# Altium schematic sheet ELC102 - ScoreBoard - TopLevel.SchDoc
size C; PageSetup: Record=PageOptions|CenterHorizontal=True|CenterVertical=True|PrintScale=0.33|XCorrection=1.00|YCorrection=1.00|PrintKind=0|BorderSize=5000000|LeftOffset=0|BottomOffset=0|Orientation=2|PaperLength=1000|PaperWidth=1000|Scale=100|PaperSource=15|PrintQuality=1200|MediaType=1|DitherType=10|PaperKind=11x17|PrintScaleMode=1
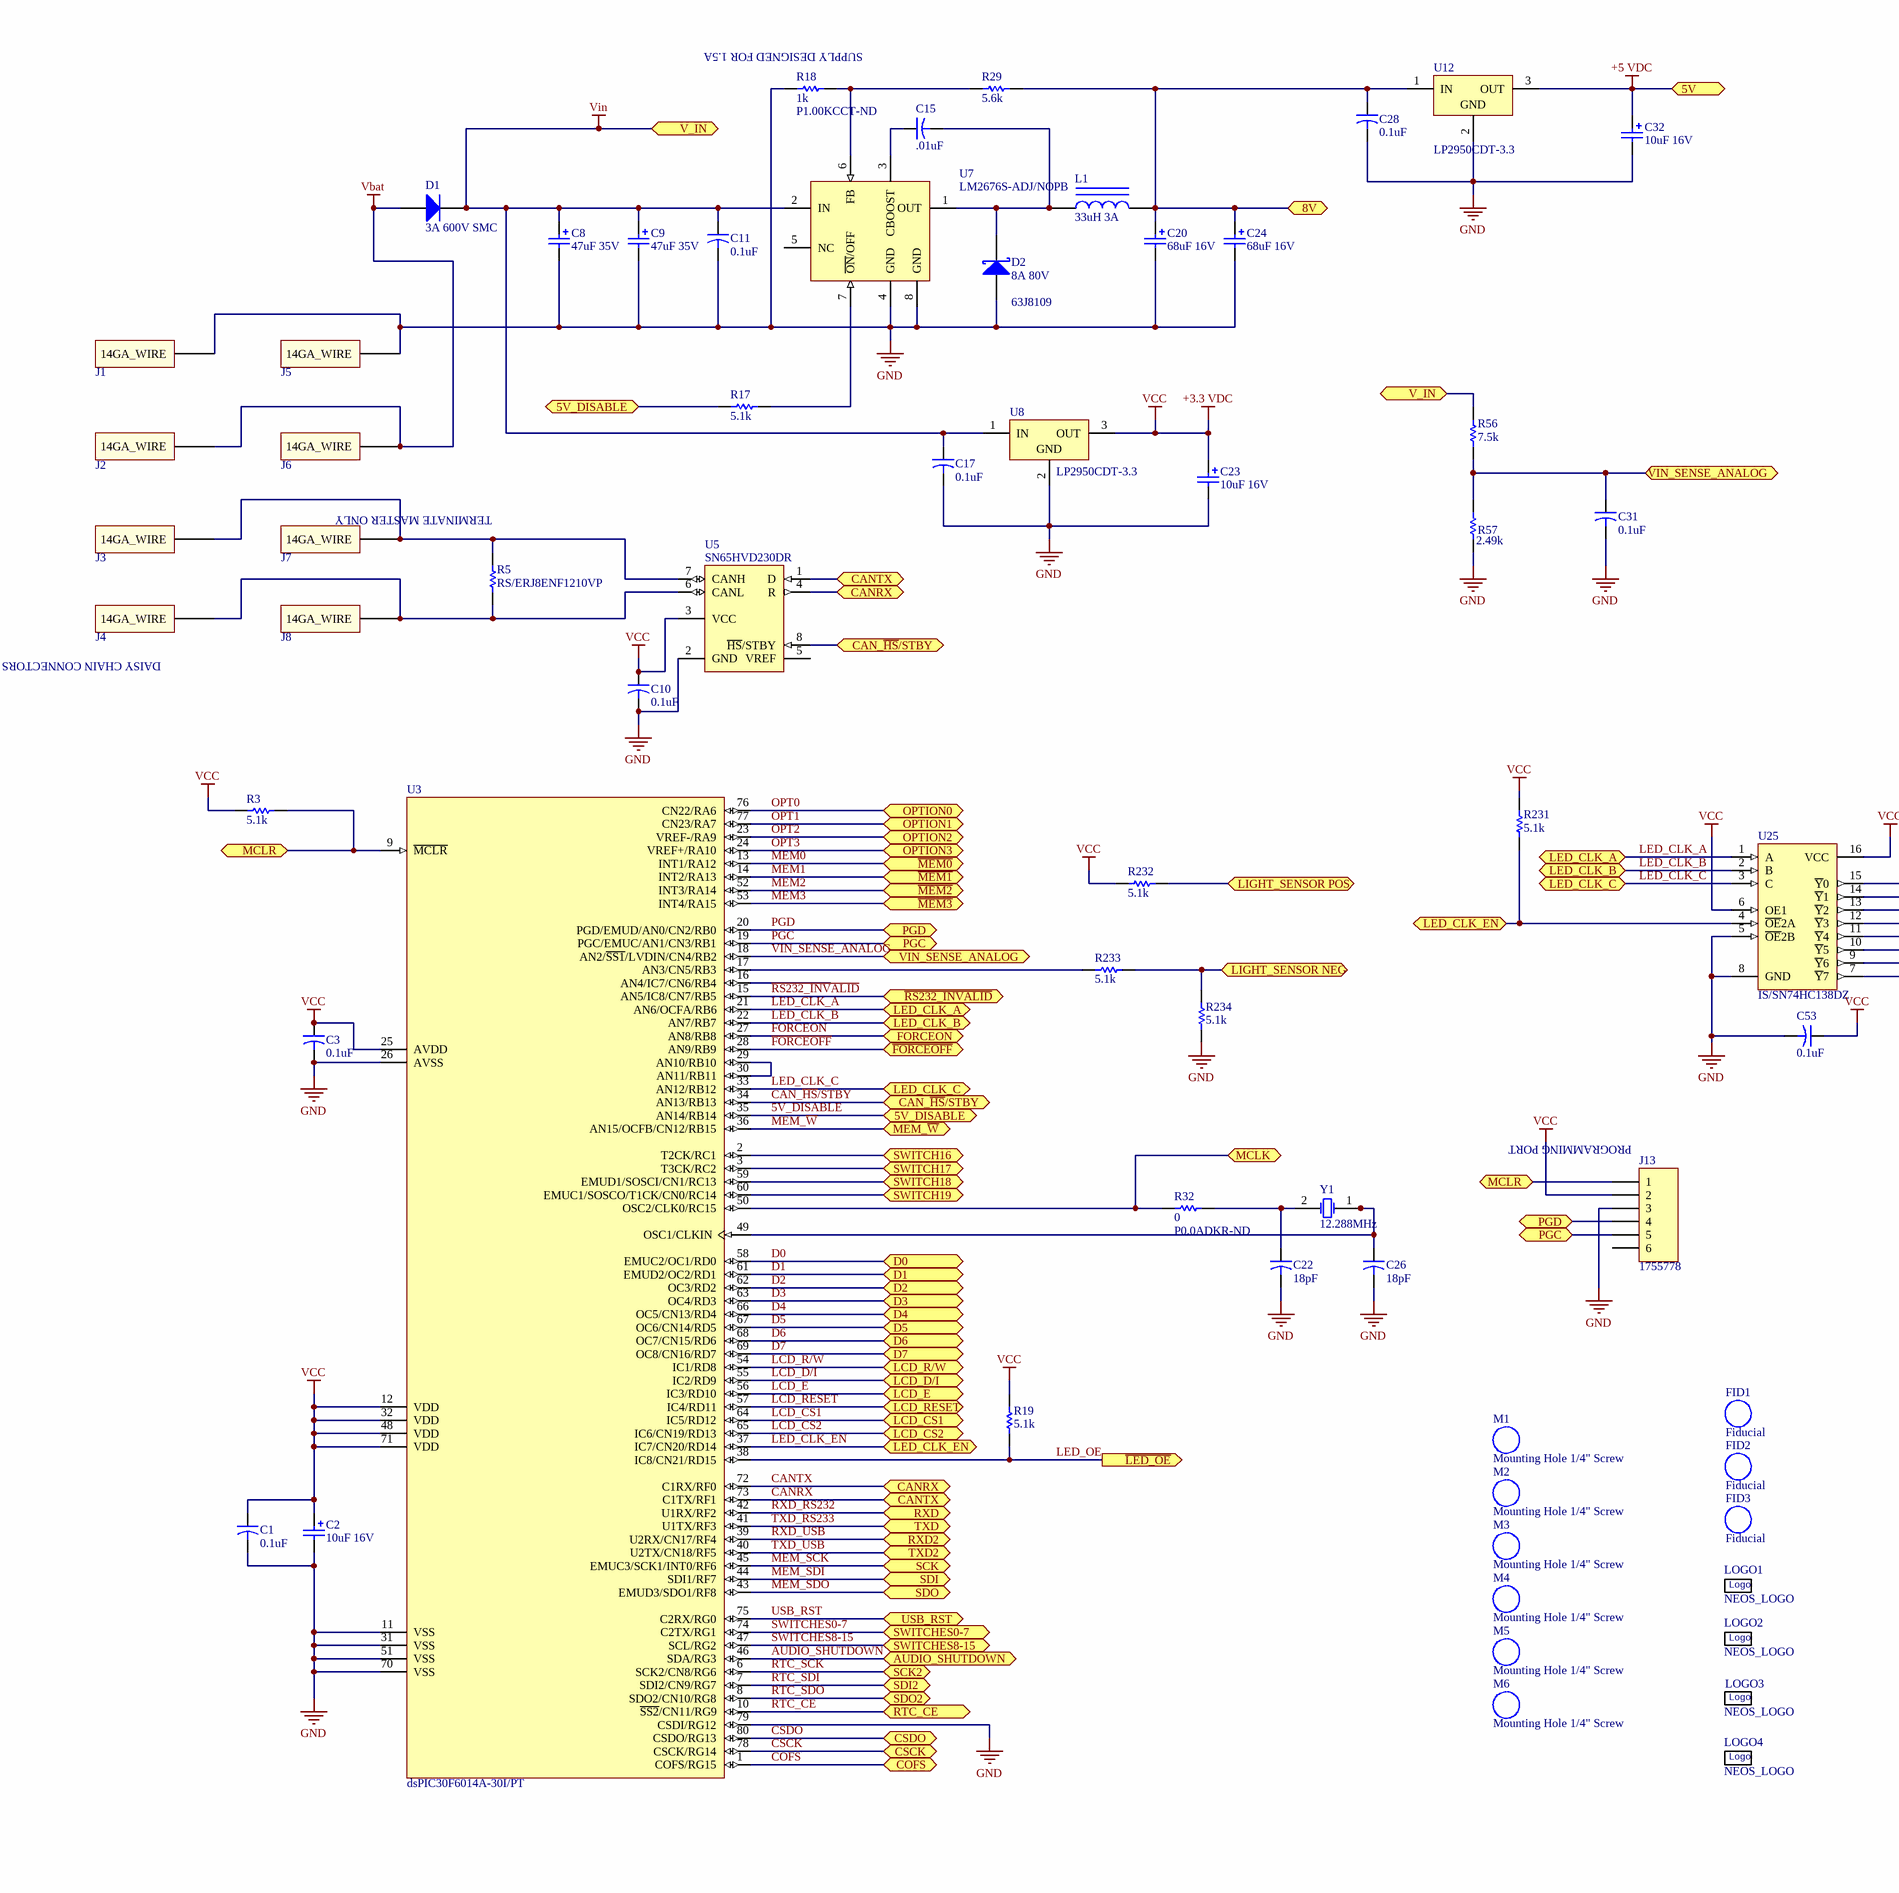
[diagram p0: ELC102 - ScoreBoard - TopLevel.SchDoc, left]
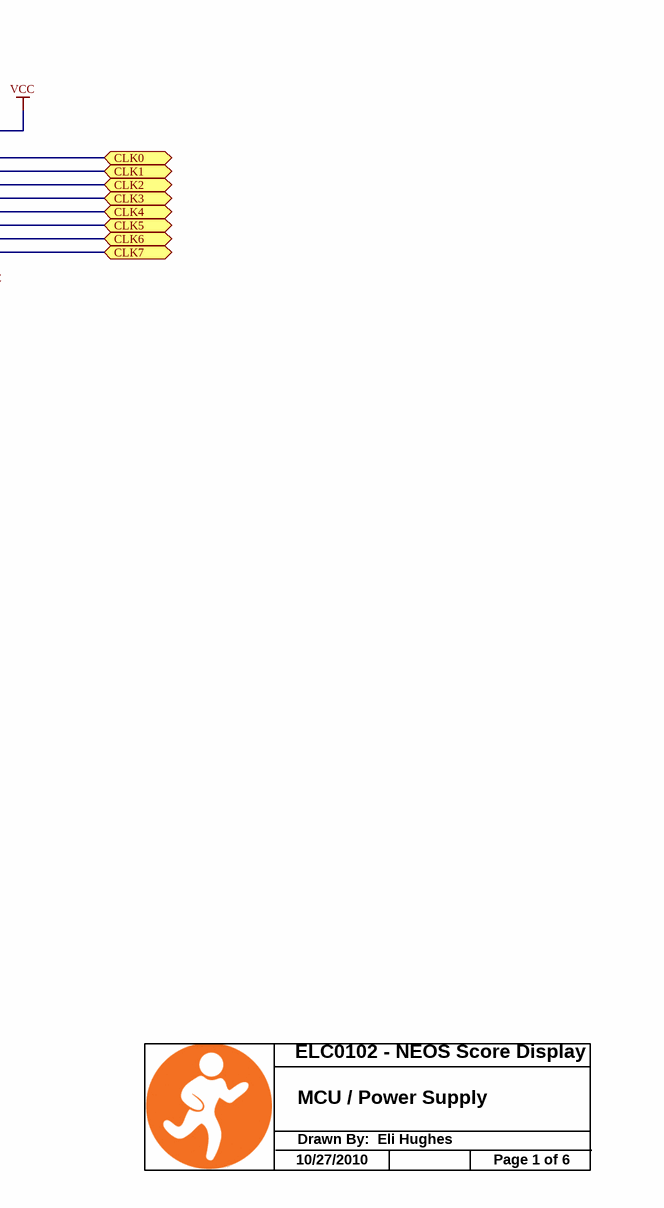
[diagram p1: ELC102 - ScoreBoard - TopLevel.SchDoc, middle]
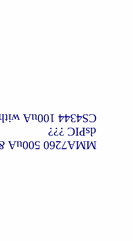
[diagram p2: ELC102 - ScoreBoard - TopLevel.SchDoc, right]

## Parts
C1  0.1uF  [C0805]
C2  10uF 16V  [C4X5.8]
C3  0.1uF  [C0805]
C8  47uF 35V  [C EIA7343-43 (X)]
C9  47uF 35V  [C EIA7343-43 (X)]
C10  0.1uF  [C0805]
C11  0.1uF  [C0805]
C15  .01uF  [C0805]
C17  0.1uF  [C0805]
C20  68uF 16V  [C7343]
C22  18pF  [C0805]
C23  10uF 16V  [C4X5.8]
C24  68uF 16V  [C7343]
C26  18pF  [C0805]
C28  0.1uF  [C0805]
C31  0.1uF  [C0805]
C32  10uF 16V  [C4X5.8]
C53  0.1uF  [C0805]
D1  3A 600V SMC  [DIODE_SMC]
D2  8A 80V  Supplier Part Number 2: 63J8109  [D2PAK]
FID1  Fiducial  [Fiducial]  (no BOM)
FID2  Fiducial  [Fiducial]  (no BOM)
FID3  Fiducial  [Fiducial]  (no BOM)
J1  ~14GA_WIRE  [WIRE_14GA]  (value not drawn)  (no BOM)
J2  ~14GA_WIRE  [WIRE_14GA]  (value not drawn)  (no BOM)
J3  ~14GA_WIRE  [WIRE_14GA]  (value not drawn)  (no BOM)
J4  ~14GA_WIRE  [WIRE_14GA]  (value not drawn)  (no BOM)
J5  ~14GA_WIRE  [WIRE_14GA]  (value not drawn)  (no BOM)
J6  ~14GA_WIRE  [WIRE_14GA]  (value not drawn)  (no BOM)
J7  ~14GA_WIRE  [WIRE_14GA]  (value not drawn)  (no BOM)
J8  ~14GA_WIRE  [WIRE_14GA]  (value not drawn)  (no BOM)
J13  1755778  [JCPM5086VE0Z]
L1  33uH 3A  [IND/DO5022]
LOGO1  NEOS_LOGO  [FULL_LOGO]  (no BOM)
LOGO2  NEOS_LOGO  [NEOS_LOGO_0]  (no BOM)
LOGO3  NEOS_LOGO  [FULL_LOGO_1]  (no BOM)
LOGO4  NEOS_LOGO  [NEOS_LOGO_1]  (no BOM)
M1  Mounting Hole 1/4" Screw  [MHole250]  (no BOM)
M2  Mounting Hole 1/4" Screw  [MHole250]  (no BOM)
M3  Mounting Hole 1/4" Screw  [MHole250]  (no BOM)
M4  Mounting Hole 1/4" Screw  [MHole250]  (no BOM)
M5  Mounting Hole 1/4" Screw  [MHole250]  (no BOM)
M6  Mounting Hole 1/4" Screw  [MHole250]  (no BOM)
R3  5.1k  [R0805]
R5  RS/ERJ8ENF1210VP  [R1206]  (no BOM)
R17  5.1k  [R0805]
R18  1k  Supplier Part Number 1: P1.00KCCT-ND  [R0805]
R19  5.1k  [R0805]
R29  5.6k  [R0805]
R32  0  Supplier Part Number 1: P0.0ADKR-ND  [R0805]
R56  7.5k  [R0805]
R57  2.49k  [R0805]
R231  5.1k  [R0805]
R232  5.1k  [R0805]
R233  5.1k  [R0805]
R234  5.1k  [R0805]
U3  dsPIC30F6014A-30I/PT  [TQFP-80]
U5  SN65HVD230DR  [SOIC 8]
U7  LM2676S-ADJ/NOPB  [TO263\7]
U8  LP2950CDT-3.3  [D-PAK / TO-252AA]
U12  LP2950CDT-3.3  [D-PAK / TO-252AA]
U25  IS/SN74HC138DZ  [SOIC 16]
Y1  12.288MHz  [XTSL\CSM-7]

## Ports
5V, 5V_DISABLE, 8V, AUDIO_SHUTDOWN, CAN_~{HS}/STBY, CANRX, CANTX, CLK0, CLK1, CLK2, CLK3, CLK4, CLK5, CLK6, CLK7, COFS, CSCK, CSDO, D0, D1, D2, D3, D4, D5, D6, D7, FORCEON, LCD_CS1, LCD_CS2, LCD_D/I, LCD_E, LCD_R/W, LCD_RESET, LED_CLK_A, LED_CLK_B, LED_CLK_C, LED_CLK_EN, LIGHT_SENSOR NEG, LIGHT_SENSOR POS, MCLK, MCLR, MEM_~{W}, OPTION0, OPTION1, OPTION2, OPTION3, PGC, PGD, RTC_CE, RXD, RXD2, SCK, SCK2, SDI, SDI2, SDO, SDO2, SWITCH16, SWITCH17, SWITCH18, SWITCH19, SWITCHES0-7, SWITCHES8-15, TXD, TXD2, USB_RST, V_IN, VIN_SENSE_ANALOG, ~{FORCEOFF}, ~{LED_OE} (out), ~{MEM0}, ~{MEM1}, ~{MEM2}, ~{MEM3}, ~{RS232_INVALID}

## Nets
+3.3 VDC: C1.1 C2.1 C3.1 C10.1 C23.1 C53.1 J13.2 R3.2 R19.1 R231.1 R232.1 U3.12(VDD) U3.25(AVDD) U3.32(VDD) U3.48(VDD) U3.71(VDD) U5.3(VCC) U8.3(OUT) U25.6(OE1) U25.16(VCC)  [also labelled VCC]
+5 VDC: C32.1 U12.3(OUT) ; port 5V
GND: C1.2 C2.2 C3.2 C8.2 C9.2 C10.2 C11.2 C17.2 C20.2 C22.2 C23.2 C24.2 C26.2 C28.2 C31.2 C32.2 C53.2 D2.3(A) J1.1(14GA_WIRE) J5.1(14GA_WIRE) J13.3 R18.1 R57.1 R234.1 U3.11(VSS) U3.26(AVSS) U3.31(VSS) U3.51(VSS) U3.70(VSS) U3.79(CSDI/RG12) U5.2(GND) U7.4(GND) U7.8(GND) U8.2(GND) U12.2(GND) U25.5(~{OE}2B) U25.8(GND)
Vbat: D1.A J2.1(14GA_WIRE) J6.1(14GA_WIRE)
Vin: C8.1 C9.1 C11.1 C17.1 D1.K R56.2 U7.2(IN) U8.1(IN) ; port V_IN
5V_DISABLE: R17.1 U3.35(AN14/RB14) ; port 5V_DISABLE
8V: C20.1 C24.1 C28.1 L1.2 R29.2 U12.1(IN) ; port 8V
AUDIO_SHUTDOWN: U3.46(SDA/RG3) ; port AUDIO_SHUTDOWN
CAN_~{HS}/STBY: U3.34(AN13/RB13) U5.8(~{HS}/STBY) ; port CAN_~{HS}/STBY
CANRX: U3.73(C1TX/RF1) U5.1(D) ; port CANTX
CANTX: U3.72(C1RX/RF0) U5.4(R) ; port CANRX
CLK0: U25.15(~{Y}0) ; port CLK0
CLK1: U25.14(~{Y}1) ; port CLK1
CLK2: U25.13(~{Y}2) ; port CLK2
CLK3: U25.12(~{Y}3) ; port CLK3
CLK4: U25.11(~{Y}4) ; port CLK4
CLK5: U25.10(~{Y}5) ; port CLK5
CLK6: U25.9(~{Y}6) ; port CLK6
CLK7: U25.7(~{Y}7) ; port CLK7
COFS: U3.1(COFS/RG15) ; port COFS
CSCK: U3.78(CSCK/RG14) ; port CSCK
CSDO: U3.80(CSDO/RG13) ; port CSDO
D0: U3.58(EMUC2/OC1/RD0) ; port D0
D1: U3.61(EMUD2/OC2/RD1) ; port D1
D2: U3.62(OC3/RD2) ; port D2
D3: U3.63(OC4/RD3) ; port D3
D4: U3.66(OC5/CN13/RD4) ; port D4
D5: U3.67(OC6/CN14/RD5) ; port D5
D6: U3.68(OC7/CN15/RD6) ; port D6
D7: U3.69(OC8/CN16/RD7) ; port D7
~{FORCEOFF}: U3.28(AN9/RB9) ; port ~{FORCEOFF}
FORCEON: U3.27(AN8/RB8) ; port FORCEON
LCD_CS1: U3.64(IC5/RD12) ; port LCD_CS1
LCD_CS2: U3.65(IC6/CN19/RD13) ; port LCD_CS2
LCD_D/I: U3.55(IC2/RD9) ; port LCD_D/I
LCD_E: U3.56(IC3/RD10) ; port LCD_E
LCD_R/W: U3.54(IC1/RD8) ; port LCD_R/W
LCD_RESET: U3.57(IC4/RD11) ; port LCD_RESET
LED_CLK_A: U3.21(AN6/OCFA/RB6) U25.1(A) ; port LED_CLK_A
LED_CLK_B: U3.22(AN7/RB7) U25.2(B) ; port LED_CLK_B
LED_CLK_C: U3.33(AN12/RB12) U25.3(C) ; port LED_CLK_C
LED_CLK_EN: R231.2 U3.37(IC7/CN20/RD14) U25.4(~{OE}2A) ; port LED_CLK_EN
LED_OE: R19.2 U3.38(IC8/CN21/RD15) ; port ~{LED_OE}
LIGHT_SENSOR NEG: R233.2 R234.2 ; port LIGHT_SENSOR NEG
LIGHT_SENSOR POS: R232.2 ; port LIGHT_SENSOR POS
MCLK: R32.1 U3.50(OSC2/CLK0/RC15) ; port MCLK
MCLR: J13.1 R3.1 U3.9(~{MCLR}) ; port MCLR
MEM0: U3.13(INT1/RA12) ; port ~{MEM0}
MEM1: U3.14(INT2/RA13) ; port ~{MEM1}
MEM2: U3.52(INT3/RA14) ; port ~{MEM2}
MEM3: U3.53(INT4/RA15) ; port ~{MEM3}
MEM_SCK: U3.45(EMUC3/SCK1/INT0/RF6) ; port SCK
MEM_SDI: U3.44(SDI1/RF7) ; port SDI
MEM_SDO: U3.43(EMUD3/SDO1/RF8) ; port SDO
MEM_~{W}: U3.36(AN15/OCFB/CN12/RB15) ; port MEM_~{W}
OPT0: U3.76(CN22/RA6) ; port OPTION0
OPT1: U3.77(CN23/RA7) ; port OPTION1
OPT2: U3.23(VREF-/RA9) ; port OPTION2
OPT3: U3.24(VREF+/RA10) ; port OPTION3
PGC: J13.5 U3.19(PGC/EMUC/AN1/CN3/RB1) ; port PGC
PGD: J13.4 U3.20(PGD/EMUD/AN0/CN2/RB0) ; port PGD
~{RS232_INVALID}: U3.15(AN5/IC8/CN7/RB5) ; port ~{RS232_INVALID}
RTC_CE: U3.10(~{SS2}/CN11/RG9) ; port RTC_CE
RTC_SCK: U3.6(SCK2/CN8/RG6) ; port SCK2
RTC_SDI: U3.7(SDI2/CN9/RG7) ; port SDI2
RTC_SDO: U3.8(SDO2/CN10/RG8) ; port SDO2
RXD_RS232: U3.42(U1RX/RF2) ; port RXD
RXD_USB: U3.39(U2RX/CN17/RF4) ; port RXD2
SWITCH16: U3.2(T2CK/RC1) ; port SWITCH16
SWITCH17: U3.3(T3CK/RC2) ; port SWITCH17
SWITCH18: U3.59(EMUD1/SOSCI/CN1/RC13) ; port SWITCH18
SWITCH19: U3.60(EMUC1/SOSCO/T1CK/CN0/RC14) ; port SWITCH19
SWITCHES0-7: U3.74(C2TX/RG1) ; port SWITCHES0-7
SWITCHES8-15: U3.47(SCL/RG2) ; port SWITCHES8-15
TXD_RS233: U3.41(U1TX/RF3) ; port TXD
TXD_USB: U3.40(U2TX/CN18/RF5) ; port TXD2
USB_RST: U3.75(C2RX/RG0) ; port USB_RST
VIN_SENSE_ANALOG: C31.1 R56.1 R57.2 U3.18(AN2/~{SS1}/LVDIN/CN4/RB2) ; port VIN_SENSE_ANALOG
NetC15_1: C15.1 U7.3(CBOOST)
NetC15_2: C15.2 D2.2(K) L1.1 U7.1(OUT)
NetC22_1: C22.1 R32.2 Y1.2(OSC2)
NetC26_1: C26.1 U3.49(OSC1/CLKIN) Y1.1(OSC1)
NetJ3_1: J3.1(14GA_WIRE) J7.1(14GA_WIRE) R5.2 U5.7(CANH)
NetJ4_1: J4.1(14GA_WIRE) J8.1(14GA_WIRE) R5.1 U5.6(CANL)
NetR17_2: R17.2 U7.7(~{ON}/OFF)
NetR18_2: R18.2 R29.1 U7.6(FB)
NetR233_1: R233.1 U3.17(AN3/CN5/RB3)
NetU3_29: U3.29(AN10/RB10) U3.30(AN11/RB11)

Not connected (* = marked no-connect by the designer): D2 1(NC); J13 6; U3 16(AN4/IC7/CN6/RB4); U5 5(VREF); U7 5(NC)

## Notes on the sheet
- (near R29) SUPPLY DESIGNED FOR 1.5A
- (near R5) TERMINATE MASTER ONLY
- (near J4) DAISY CHAIN CONNECTORS
- (near J13) PROGRAMMING PORT
- CS4344 100uA with clk/data static
- dsPIC ???
- MMA7260 500uA & only 3uA sleep
- ELC0102 - NEOS Score Display
- MCU / Power Supply
- 10/27/2010
- Drawn By:  Eli Hughes
- Page 1 of 6
- (in symbol NEOS_LOGO) Logo

## Library data of the parts
C1 C3 C10 C11 C17 C28 C31 C53 = CS/C0805C104K5RACK: CAP .10UF 50V CERAMIC X7R 0805; Manufacturer: Kemet; Manufacturer Part Number: C0805C104K5RACTU; Source Part Number: 399-1170-2-ND; Capacitance: 0.1µF; Tolerance: ±10%; ROHS Certificate: Lead free / RoHS compliant; Source: Digikey; Value: 0.1uF; Supplier 1: Digi-Key; RoHS: RoHS Compliant; Category: Capacitors; Stock 1: 10120790; Pricing 1: 10=0.105, 100=0.0378, 250=0.02732, 500=0.02016, 1000=0.01365 (USD); Voltage - Rated: 50V; Temperature Coefficient: X7R; Mounting Type: Surface Mount, MLCC; Operating Temperature: -55°C ~ 125°C; Features: -; Applications: General Purpose; Ratings: -; Package / Case: 0805 (2012 Metric); Size / Dimension: 0.079" L x 0.049" W (2.00mm x 1.25mm); Lead Spacing: -; Thickness: 0.90mm; Packaging: Cut Tape (CT); Lead Style: -; ComponentLink1URL: http://www.kemet.com/datasheets&C0805C104K5RACTU; ComponentLink1Description: http://www.kemet.com/datasheets&C0805C104K5RACTU; Supplier Part Number 1: 399-1170-1-ND
C2 C23 C32 = CS/EEVFK1C100RP: Panasonic 10uF 16V SMT; Manufacturer: Panasonic - ECG; Manufacturer Part Number: EEE-FK1C100R; Source Part Number: PCE3782TR-ND; Value: EEE-FK1C100R; Description: CAP ELECT 10UF 16V FK SMD; Capacitance: 10µF; Tolerance: ±20%; Lifetime @ Temp.: 2000 Hrs @ 105°C; Ripple Current: 90mA; Impedance: 1.35 Ohm; Surface Mount Land Size: 0.169" L x 0.169" W (4.30mm x 4.30mm); ROHS Certificate: Lead free / RoHS compliant; Source: Digikey; Supplier 1: Digi-Key; RoHS: RoHS Compliant; Category: Capacitors; Stock 1: 412703; Pricing 1: 1=0.54, 50=0.309, 100=0.2575, 250=0.19312, 500=0.1648, 1000=0.12875 (USD); Voltage Rating: 16V; Operating Temperature: -55°C ~ 105°C; Features: General Purpose; ESR (Equivalent Series Resistance): -; Mounting Type: Surface Mount; Package / Case: Radial, Can - SMD; Size / Dimension: 0.157" Dia (4.00mm); Height: 0.228" (5.80mm); Lead Spacing: -; Packaging: Cut Tape (CT); ComponentLink1URL: http://industrial.panasonic.com/www-cgi/jvcr13pz.cgi?E+PZ+3+ABA0120+EEEFK1C100R+7+WW; ComponentLink1Description: http://industrial.panasonic.com/www-cgi/jvcr13pz.cgi?E+PZ+3+ABA0120+EEEFK1C100R+7+WW; Supplier Part Number 1: PCE3782CT-ND
C8 C9 = C#S/T491X476K035ATK: Kemet Tantalum 47uF 35V EIA7343-43; Source Part Number: 399-3821-2-ND; Manufacturer: Kemet; Manufacturer Part Number: T491X476K035AT; ROHS Certificate: Lead free / RoHS compliant; Source: Digikey; Value: T491X476K035AT; Supplier 1: Digi-Key; Supplier Part Number 1: 399-3821-1-ND
C15 = CS/C0805C103K5RAC: CAP 10000PF 50V CERAMIC X7R 0805; Manufacturer: Kemet; Manufacturer Part Number: C0805C103K5RACTU; Source Part Number: 399-1158-2-ND; Tolerance: ±10%; ROHS Certificate: Lead free / RoHS compliant; Source: Digikey; Value: .01uF; Supplier 1: Digi-Key; RoHS: RoHS Compliant; Category: Capacitors; Stock 1: 1770160; Pricing 1: 10=0.07, 100=0.0252, 250=0.0182, 500=0.01344, 1000=0.0091 (USD); Capacitance: 10000pF; Voltage - Rated: 50V; Temperature Coefficient: X7R; Mounting Type: Surface Mount, MLCC; Operating Temperature: -55°C ~ 125°C; Features: -; Applications: General Purpose; Ratings: -; Package / Case: 0805 (2012 Metric); Size / Dimension: 0.079" L x 0.049" W (2.00mm x 1.25mm); Lead Spacing: -; Thickness: 0.78mm; Packaging: Cut Tape (CT); Lead Style: -; ComponentLink1URL: http://www.kemet.com/datasheets&C0805C103K5RACTU; ComponentLink1Description: http://www.kemet.com/datasheets&C0805C103K5RACTU; Supplier Part Number 1: 399-1158-1-ND
C20 C24 = CS/T495D686K016ASE1K: CAPACITOR TANT 68UF 16V 10% SMD; Manufacturer: Kemet; Manufacturer Part Number: T495D686K016ATE150; Source Part Number: 399-3889-2-ND; Manufacturer Size Code: D; Value: T495D686K016ATE150; Capacitance: 68µF; ESR (Equivalent Series Resistance): 150.0 mOhm; Type: Molded; ROHS Certificate: Lead free / RoHS compliant; Source: Digikey; Supplier 1: Digi-Key; RoHS: RoHS Compliant; Category: Capacitors; Stock 1: 568; Pricing 1: 1=1.35, 10=1.128, 25=0.972, 100=0.828, 250=0.72 (USD); Voltage - Rated: 16V; Tolerance: ±10%; Operating Temperature: -55°C ~ 125°C; Mounting Type: Surface Mount; Package / Case: 2917 (7343 Metric); Size / Dimension: 0.287" L x 0.169" W (7.30mm x 4.30mm); Height: 0.110" (2.80mm); Lead Spacing: -; Features: General Purpose; Packaging: Cut Tape (CT); Lifetime @ Temp.: -; ComponentLink1URL: http://www.kemet.com/datasheets&T495D686K016ATE150; ComponentLink1Description: http://www.kemet.com/datasheets&T495D686K016ATE150; Supplier Part Number 1: 399-3889-1-ND
C22 C26 = CS/C0805C180J5GACTUK: CAP CERAMIC 18PF 50V NP0 0805; Manufacturer: Kemet; Source Part Number: 399-1112-2-ND; Tolerance: ±5%; Temperature Coefficient: C0G, NP0; Manufacturer Part Number: C0805C180J5GACTU; ROHS Certificate: Lead free / RoHS compliant; Source: Digikey; Value: C0805C180J5GACTU; Supplier 1: Digi-Key; RoHS: RoHS Compliant; Category: Capacitors; Stock 1: 156000; Pricing 1: 10=0.17, 100=0.0612, 250=0.0442, 500=0.03264, 1000=0.0221 (USD); Capacitance: 18pF; Voltage - Rated: 50V; Mounting Type: Surface Mount, MLCC; Operating Temperature: -55°C ~ 125°C; Features: -; Applications: General Purpose; Ratings: -; Package / Case: 0805 (2012 Metric); Size / Dimension: 0.079" L x 0.049" W (2.00mm x 1.25mm); Lead Spacing: -; Thickness: 0.78mm; Packaging: Cut Tape (CT); Lead Style: -; ComponentLink1URL: http://www.kemet.com/datasheets&C0805C180J5GACTU; ComponentLink1Description: http://www.kemet.com/datasheets&C0805C180J5GACTU; Supplier Part Number 1: 399-1112-1-ND
D1 = D#S/MURS360T3GM: Diode 3A 600V SMC; Manufacturer: ON Semiconductor; Source Part Number: MURS360T3GOSTR-ND; Description: DIODE ULTRA FAST 3A 600V SMC; Voltage - Forward (Vf) (Max) @ If: 1.28V @ 4A; Current - Average Rectified (Io): 4A; Current - Reverse Leakage @ Vr: 10µA @ 600V; Diode Type: Standard; Speed: Fast Recovery =< 500ns, > 200mA (Io); Reverse Recovery Time (trr): 75ns; Manufacturer Part Number: MURS360T3G; ROHS Certificate: Lead free / RoHS compliant; Source: Digikey; Value: MURS360T3G; Supplier 1: Digi-Key; RoHS: RoHS Compliant; Category: Discrete Semiconductor Products; Stock 1: 0; Pricing 1: 1=0.73, 10=0.628, 100=0.4961, 250=0.42992, 500=0.36378, 1000=0.28936 (USD); Voltage - DC Reverse (Vr) (Max): 600V; Capacitance @ Vr, F: -; Mounting Type: Surface Mount; Package / Case: DO-214AB, SMC; Packaging: Cut Tape (CT); Supplier Device Package: SMCJ (DO-214AB); ComponentLink1URL: http://www.onsemi.com/pub_link/Collateral/MURS320T3-D.PDF; ComponentLink1Description: http://www.onsemi.com/pub_link/Collateral/MURS320T3-D.PDF; Supplier Part Number 1: MURS360T3GOSCT-ND
D2 = DS/8TQ080S0Z: IR Schottky Diode 8A 80V D2PAK; Manufacturer: Vishay IR; Manufacturer Part Number: 8TQ080SPBF; Source Part Number: 8TQ080SPBF-ND; Value: 8TQ080SPBF; Description: VISHAY FORMERLY I.R. - 8TQ080SPBF - SCHOTTKY RECTIFIER, 8A, 80V, D2-PAK; Repetitive Reverse Voltage Max, Vrrm: 80; Forward Current (AV): 8; Forward Voltage Max, VF: 720; Forward Surge Current Max, Ifsm: 850; ROHS Certificate: Lead free / RoHS compliant; Source: Digikey; Supplier 1: Digi-Key; Supplier 2: Newark; RoHS: YES; Category: Semiconductors - Discretes; Stock 2: 834; Pricing 2: 1=3.34, 10=3.2, 100=3.08, 1000=2.53, 5000=2.27, 10000=2.1 (USD); Diode Type: Schottky; ComponentLink1URL: http://www.vishay.com/docs/94266/94266.pdf; ComponentLink1Description: http://www.vishay.com/docs/94266/94266.pdf; Supplier Part Number 1: 8TQ080SPBF-ND
J13 = JCPM5086VE0Z: CONN HEADER VERT 6POS 5.08MM; Manufacturer: Phoenix Contact; Positions Per Level: 6; Pitch: 0.200" (5.08mm); Number of Levels: 1; Header Orientation: Vertical; Current: 10A; Voltage: 300V; Manufacturer Part Number: 1755778; Supplier 1: Digi-Key; RoHS: RoHS Compliant; Category: Connectors, Interconnects; Stock 1: 1381; Pricing 1: 1=1.41, 10=1.37, 50=1.28, 100=1.1776, 250=1.088, 500=1.0368, 1000=0.9728 (USD); Terminal Block Type: Header, Male Pins, Shrouded (4 Side); Plug Wire Entry: -; Termination: Solder; Wire Gauge: -; Mounting Type: Through Hole; Features: -; Color: Green; Packaging: Bulk; ComponentLink1URL: http://media.digikey.com/pdf/Data%20Sheets/Phoenix%20Contact%20PDFs/1755778.pdf; Supplier Part Number 1: 277-1154-ND; ComponentLink1Description: http://media.digikey.com/pdf/Data%20Sheets/Phoenix%20Contact%20PDFs/1755778.pdf; Value: 1755778
L1 = NS/DO5022P333Z: Magnetic-Core Inductor; Manufacturer: Coilcraft; Manufacturer Part Number: DO5022P-333MLD; Supplier 1: Coilcraft; Supplier Part Number 1: DO5022P-333MLD; Value: 33uH 3A
M1-M6 = MountingHole_1/4
R3 R17 R19 R231-R234 = ERJ-6ENF5101V: RES 5.10K OHM 1/8W 1% 0805 SMD; Manufacturer: Panasonic - ECG; Power (Watts): 0.125W, 1/8W; Temperature Coefficient: ±100ppm/°C; ComponentLink1Description: http://industrial.panasonic.com/www-cgi/jvcr13pz.cgi?E+PZ+3+AOA0002+ERJ6ENF5101V+7+WW; ComponentLink1URL: http://industrial.panasonic.com/www-cgi/jvcr13pz.cgi?E+PZ+3+AOA0002+ERJ6ENF5101V+7+WW; Value: 5.1k; Supplier 1: Digi-Key; Manufacturer Part Number: ERJ-6ENF5101V; RoHS: RoHS Compliant; Category: Resistors; Stock 1: 32293; Pricing 1: 1=0.07, 50=0.0276, 100=0.021, 250=0.0156, 500=0.01152, 1000=0.00768 (USD); Resistance In Ohms: 5.10K; Composition: Thick Film; Features: -; Tolerance: ±1%; Case: 0805 (2012 metric); Size / Dimension: 0.079" L x 0.049" W (2.00mm x 1.25mm); Height: 0.024" (0.60mm); Lead Style: Surface Mount (SMD - SMT); Packaging: Digi-Reel®; Supplier Part Number 1: P5.10KCDKR-ND
R5 = RS/ERJ8ENF: Panasonic resistor MF 1% SMT; Value: 121; Published: 17-Dec-2003; LatestRevisionDate: 19-Mar-2004; LatestRevisionNote: Silkscreen size reduced.; PackageDocument: Mar-2003; PackageReference: 6-0805; Publisher: Altium Limited; ComponentLink1Description: Manufacturer Link; ComponentLink1URL: http://www.panasonic.com/flash.html; Code_IPC: 2012 [0805]
R18 = ERJ-6ENF1001V: RES 1.00K OHM 1/8W 1% 0805 SMD; Manufacturer: Panasonic - ECG; Value: 1k 1%; Power (Watts): 0.125W, 1/8W; Temperature Coefficient: ±100ppm/°C; Manufacturer Part Number: ERJ-6ENF1001V; Source: Digikey; Source Part Number: P1.00KCCT-ND; ROHS Certificate: *; Supplier 1: Digi-Key; RoHS: RoHS Compliant; Category: Resistors; Stock 1: 988564; Pricing 1: 1=0.07, 50=0.0276, 100=0.021, 250=0.0156, 500=0.01152, 1000=0.00768 (USD); Resistance In Ohms: 1.00K; Composition: Thick Film; Features: -; Tolerance: ±1%; Case: 0805 (2012 metric); Size / Dimension: 0.079" L x 0.049" W (2.00mm x 1.25mm); Height: 0.024" (0.60mm); Lead Style: Surface Mount (SMD - SMT); Packaging: Cut Tape (CT); ComponentLink1URL: http://industrial.panasonic.com/www-cgi/jvcr13pz.cgi?E+PZ+3+AOA0002+ERJ6ENF1001V+7+WW; ComponentLink1Description: http://industrial.panasonic.com/www-cgi/jvcr13pz.cgi?E+PZ+3+AOA0002+ERJ6ENF1001V+7+WW
R29 = ERJ-6ENF5601V: RES 5.60K OHM 1/8W 1% 0805 SMD; Manufacturer: Panasonic - ECG; Power (Watts): 0.125W, 1/8W; Temperature Coefficient: ±100ppm/°C; ComponentLink1Description: http://industrial.panasonic.com/www-cgi/jvcr13pz.cgi?E+PZ+3+AOA0002+ERJ6ENF5601V+7+WW; ComponentLink1URL: http://industrial.panasonic.com/www-cgi/jvcr13pz.cgi?E+PZ+3+AOA0002+ERJ6ENF5601V+7+WW; Value: 5.6k; Supplier 1: Digi-Key; Manufacturer Part Number: ERJ-6ENF5601V; RoHS: RoHS Compliant; Category: Resistors; Stock 1: 0; Resistance In Ohms: 5.60K; Composition: Thick Film; Features: -; Tolerance: ±1%; Case: 0805 (2012 metric); Size / Dimension: 0.079" L x 0.049" W (2.00mm x 1.25mm); Height: 0.024" (0.60mm); Lead Style: Surface Mount (SMD - SMT); Packaging: Cut Tape (CT); Supplier Part Number 1: P5.60KCCT-ND
R32 = ERJ-6GEY0R00V: RES 0.0 OHM 1/8W 5% 0805 SMD; Source Part Number: P0.0ACT-ND; Manufacturer: Panasonic - ECG; Description: RES 0.0 OHM 1/8W 0805 SMD; Resistance In Ohms: 0.0; Power (Watts): 0.125W, 1/8W; Temperature Coefficient: -100/ +600ppm/°C; Tolerance: Jumper; Value: RES 0.0 OHM 1/8W 5% 0805 SMD; Source: Digikey; Manufacturer Part Number: ERJ-6GEY0R00V; ROHS Certificate: *; Supplier 1: Digi-Key; RoHS: RoHS Compliant; Category: Resistors; Stock 1: 2923930; Pricing 1: 1=0.04, 50=0.0162, 100=0.0123, 250=0.00912, 500=0.00672, 1000=0.00448 (USD); Composition: Thick Film; Features: -; Case: 0805 (2012 metric); Size / Dimension: 0.079" L x 0.049" W (2.00mm x 1.25mm); Height: 0.024" (0.60mm); Lead Style: Surface Mount (SMD - SMT); Packaging: Digi-Reel®; ComponentLink1URL: http://industrial.panasonic.com/www-cgi/jvcr13pz.cgi?E+PZ+3+AOA0001+ERJ6GEY0R00V+7+WW; ComponentLink1Description: http://industrial.panasonic.com/www-cgi/jvcr13pz.cgi?E+PZ+3+AOA0001+ERJ6GEY0R00V+7+WW
R56 = ERJ-6ENF7501V: RES 7.50K OHM 1/8W 1% 0805 SMD; Manufacturer: Panasonic - ECG; Power (Watts): 0.125W, 1/8W; Temperature Coefficient: ±100ppm/°C; ComponentLink1Description: http://industrial.panasonic.com/www-cgi/jvcr13pz.cgi?E+PZ+3+AOA0002+ERJ6ENF7501V+7+WW; ComponentLink1URL: http://industrial.panasonic.com/www-cgi/jvcr13pz.cgi?E+PZ+3+AOA0002+ERJ6ENF7501V+7+WW; Value: 7.5k; Supplier 1: Digi-Key; Manufacturer Part Number: ERJ-6ENF7501V; RoHS: RoHS Compliant; Category: Resistors; Stock 1: 212114; Resistance In Ohms: 7.50K; Composition: Thick Film; Features: -; Tolerance: ±1%; Case: 0805 (2012 metric); Size / Dimension: 0.079" L x 0.049" W (2.00mm x 1.25mm); Height: 0.024" (0.60mm); Lead Style: Surface Mount (SMD - SMT); Packaging: Cut Tape (CT); Supplier Part Number 1: P7.50KCCT-ND
R57 = ERJ-6ENF2491V: RES 2.49K OHM 1/8W 1% 0805 SMD; Manufacturer: Panasonic - ECG; Power (Watts): 0.125W, 1/8W; Temperature Coefficient: ±100ppm/°C; ComponentLink1Description: http://industrial.panasonic.com/www-cgi/jvcr13pz.cgi?E+PZ+3+AOA0002+ERJ6ENF2491V+7+WW; ComponentLink1URL: http://industrial.panasonic.com/www-cgi/jvcr13pz.cgi?E+PZ+3+AOA0002+ERJ6ENF2491V+7+WW; Value: 2.49k; Supplier 1: Digi-Key; Manufacturer Part Number: ERJ-6ENF2491V; RoHS: RoHS Compliant; Category: Resistors; Stock 1: 343258; Resistance In Ohms: 2.49K; Composition: Thick Film; Features: -; Tolerance: ±1%; Case: 0805 (2012 metric); Size / Dimension: 0.079" L x 0.049" W (2.00mm x 1.25mm); Height: 0.024" (0.60mm); Lead Style: Surface Mount (SMD - SMT); Packaging: Cut Tape (CT); Supplier Part Number 1: P2.49KCCT-ND
U3 = I#S/DSPIC30F6014A30IPTZ: Microchip dsPIC30F6014A 80-TQFP; Manufacturer: Microchip Technology; Source Part Number: DSPIC30F6014A30IP-ND; Description: IC DSPIC MCU/DSP 144K 80TQFP; Core Processor: dsPIC; Core Size: 16-Bit; Speed: 30 MIPs; Connectivity: CAN, I²C, SPI, UART/USART; Peripherals: AC'97, Brown-out Detect/Reset, I²S, LVD, POR, PWM, WDT; Number of I /O: 68; Program Memory Size: 144KB (48K x 24); Program Memory Type: FLASH; EEPROM Size: 4K x 8; RAM Size: 8K x 8; Voltage - Supply (Vcc/Vdd): 2.5 V ~ 5.5 V; Data Converters: A/D 16x12b; Oscillator Type: Internal; Manufacturer Part Number: DSPIC30F6014A-30I/PT; ROHS Certificate: Lead free / RoHS compliant; Source: Digikey; Value: DSPIC30F6014A-30I/PT; Supplier 1: Digi-Key; RoHS: RoHS Compliant; Category: Integrated Circuits (ICs); Stock 1: 2428; Pricing 1: 1=12.76, 10=10.03, 25=9.11, 100=8.28 (USD); Operating Temperature: -40°C ~ 85°C; Package / Case: 80-TFQFP; Packaging: Tray; ComponentLink1URL: http://ww1.microchip.com/downloads/en/DeviceDoc/70143D.pdf; ComponentLink1Description: http://ww1.microchip.com/downloads/en/DeviceDoc/70143D.pdf; Supplier Part Number 1: DSPIC30F6014A30IP-ND
U5 = IS/SN65HVD230DRT: CAN Transceiver 3.3V w/standby; Manufacturer: Texas Instruments; Source Part Number: 296-11654-1-ND; Description: IC 3.3V CAN TXRX W/STNDBY 8-SOIC; Number of Drivers/Receivers: 1/1; Voltage - Supply: 3 V ~ 3.6 V; Manufacturer Part Number: SN65HVD230DR; ROHS Certificate: Lead free / RoHS compliant; Source: Digikey; Value: SN65HVD230DR; Supplier 1: Digi-Key; RoHS: RoHS Compliant; Category: Integrated Circuits (ICs); Stock 1: 14262; Pricing 1: 1=4.05, 25=3.3076, 100=2.97, 250=2.7, 500=2.3625, 1000=2.025 (USD); Type: Transceiver; Protocol: CAN; Mounting Type: Surface Mount; Package / Case: 8-SOIC (0.154", 3.90mm Width); Packaging: Cut Tape (CT); Supplier Device Package: *; ComponentLink1URL: http://focus.ti.com/lit/ds/symlink/sn65hvd230.pdf; ComponentLink1Description: http://focus.ti.com/lit/ds/symlink/sn65hvd230.pdf; Supplier Part Number 1: 296-11654-1-ND
U7 = IS/LM2676SADJN: Simple Switcher Power Converter 150 kHz 3A Step Down Voltage Regulator; Manufacturer: NATIONAL SEMICONDUCTOR; Description: NATIONAL SEMICONDUCTOR - LM2676S-ADJ/NOPB - IC, STEP-DOWN REGULATOR, TO-263-7; No. of Outputs: 1; Output Voltage: 37; Output Current: 3; No. of Pins: 7; Input Voltage Primary Max: 40; Manufacturer Part Number: LM2676S-ADJ/NOPB; Value: LM2676S-ADJ/NOPB; Supplier 1: Newark; RoHS: YES; Category: Semiconductors - ICs; Stock 1: 6123; Pricing 1: 1=4.69, 25=3.75, 100=3.19, 250=2.94, 500=2.82, 1000=2.78, 5000=2.72, 5000=2.66 (USD); ComponentLink1URL: http://www.national.com/ds/LM/LM2676.pdf; ComponentLink1Description: http://www.national.com/ds/LM/LM2676.pdf; Supplier Part Number 1: 41K4150; Operating Temperature Range: -40°C to +125; Output Current Max: 3; Output Voltage Max: 37
U8 U12 = IS/LP2950CDT33N: National Voltage reculator 3.3V DPAK; Manufacturer: National Semiconductor; Manufacturer Part Number: LP2950CDT-3.0; Source Part Number: LP2950CDT-3.0-ND; Value: LP2950CDT-3.0; Description: IC VREG MICROPOWER TO-252; Regulator Topology: Positive Fixed; Voltage - Output: 3V; Voltage - Input: Up to 30V; Voltage - Dropout (Typical): 0.38V @ 100mA; Number of Regulators: 1; Current - Output: 100mA; ROHS Certificate: Lead free / RoHS compliant; Source: Digikey; Supplier 1: Digi-Key; RoHS: RoHS Compliant; Category: Integrated Circuits (ICs); Stock 1: 0; Pricing 1: 750=0.664 (USD); Current - Limit (Min): -; Operating Temperature: -40°C ~ 125°C; Mounting Type: Surface Mount; Package / Case: TO-252-2, DPak (2 Leads + Tab), TO-252AA, SC-63; Packaging: Tube; Supplier Device Package: TO-252, (D-Pak); ComponentLink1URL: http://www.national.com/ds/LP/LP2950.pdf; ComponentLink1Description: http://www.national.com/ds/LP/LP2950.pdf; Supplier Part Number 1: LP2950CDT-3.0-ND
U25 = IS/SN74HC138DZ: 3-Line to 8-Line Decoder / Demultiplexer; Manufacturer: Texas Instruments; Manufacturer Part Number: SN74HC138DR; Source Part Number: 296-1193-2-ND; Value: SN74HC138DR; Description: IC 3-8 LINE DECOD/DEMUX 16-SOIC; Circuit: 1 x 3:8; Independent Circuits: 1; Current - Output High, Low: 5.2mA, 5.2mA; Voltage Supply Source: Single Supply; Voltage - Supply: 2 V ~ 6 V; ROHS Certificate: Lead free / RoHS compliant; Source: Digikey; Supplier 1: Digi-Key; RoHS: RoHS Compliant; Category: Integrated Circuits (ICs); Stock 1: 19341; Pricing 1: 1=0.58, 25=0.38, 100=0.312, 250=0.26, 500=0.216, 1000=0.16 (USD); Type: Decoder/Demultiplexer; Operating Temperature: -40°C ~ 85°C; Mounting Type: Surface Mount; Package / Case: 16-SOIC (0.154", 3.90mm Width); Packaging: Cut Tape (CT); Supplier Device Package: *; ComponentLink1URL: http://focus.ti.com/lit/ds/symlink/sn74hc138.pdf; ComponentLink1Description: http://focus.ti.com/lit/ds/symlink/sn74hc138.pdf; Supplier Part Number 1: 296-1193-1-ND
Y1 = ZS/ECS1228205PTRZ: ECS Crystal 12.288MHz SMT CSM-7; Manufacturer: Citizen America Corporation - Component Sales Division; Manufacturer Part Number: HCM49 12.288MABJ-UT; Source Part Number: 300-8550-2-ND; Value: HCM49 12.288MABJ-UT; Description: CRYSTAL 12.288 MHZ 18PF SMD; Frequency Stability: ±50ppm; Frequency Tolerance: ±30ppm; Load Capacitance: 18pF; Operating Mode: Fundamental; ROHS Certificate: Lead free / RoHS compliant; Source: Digikey; Supplier 1: Digi-Key; RoHS: RoHS Compliant; Category: Crystals and Oscillators; Stock 1: 4610; Pricing 1: 1=0.75, 10=0.65, 50=0.57, 100=0.45, 500=0.38 (USD); Type: -; Frequency: 12.288MHz; Operating Temperature: -40°C ~ 85°C; Mounting Type: Surface Mount; Package / Case: HC49/US; Packaging: Cut Tape (CT); ComponentLink1URL: http://www.citizencrystal.com/images/pdf/m-hcm49.pdf; ComponentLink1Description: http://www.citizencrystal.com/images/pdf/m-hcm49.pdf; Supplier Part Number 1: 300-8550-1-ND
LOGO1-LOGO4 = NEOS_LOGO: Manufacturer: *; Manufacturer Part Number: *; Source: *; Source Part Number: *; Value: *; ROHS Certificate: *